# Altium project CCCSN.PrjPcb
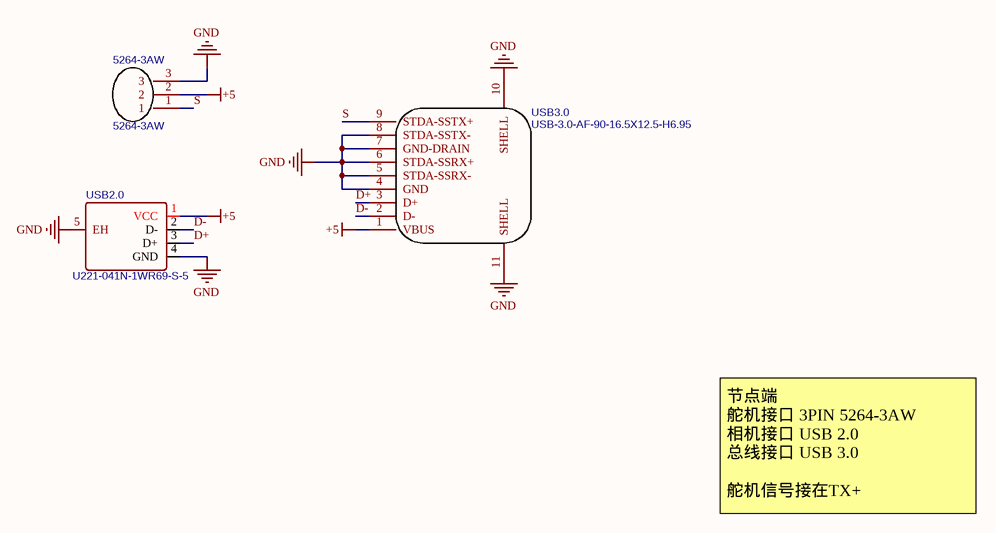
[diagram p0: Switchboard_node.SchDoc]
3 sheets, 18 parts. Net scope: global (net labels, ports and power ports of the same name join across sheets).
Board files: Switchboard_node.PcbDoc, Switchboard_host.PcbDoc, Power.PcbDoc
Sheets:
  Switchboard_node.SchDoc
  Switchboard_host.SchDoc
  Power.SchDoc

## Sheet Switchboard_node.SchDoc
size A4

### Parts
(Parts that share a designator on the sheet are numbered #1, #2 ... from top to bottom, then left to right.)
5264-3AW  5264-3AW  [CONN-TH_5264-3AW]
USB2.0#1  U221-041N-1WR69-S-5  [USB-A-TH_U221-041N-1WR69-S-5]
USB3.0#1  USB-3.0-AF-90-16.5X12.5-H6.95  [USB-3.0-TH_C69073]

### Nets
+5: 5264-3AW.2 USB2.0#1.1(VCC) USB3.0#1.1(VBUS)
GND: 5264-3AW.3 USB2.0#1.4(GND) USB2.0#1.5(EH) USB3.0#1.4(GND) USB3.0#1.5(STDA-SSRX-) USB3.0#1.6(STDA-SSRX+) USB3.0#1.7(GND-DRAIN) USB3.0#1.8(STDA-SSTX-) USB3.0#1.10(SHELL) USB3.0#1.11(SHELL)
D+: USB2.0#1.3(D+) USB3.0#1.3(D+)
D-: USB2.0#1.2(D-) USB3.0#1.2(D-)
S: 5264-3AW.1 USB3.0#1.9(STDA-SSTX+)

### Notes on the sheet
- 节点端
  舵机接口 3PIN 5264-3AW
  相机接口 USB 2.0
  总线接口 USB 3.0
  舵机信号接在TX+

### Library data of the parts
5264-3AW = 5264-3AW: BOM_Manufacturer: ReliaPro; BOM_Paste Type: expand; BOM_Supplier: LCSC; BOM_Manufacturer Part: 5264-3AW; BOM_Supplier Part: C48374; spicePre: C; spiceSymbolName: 5264-3AW
USB2.0#1 = U221-041N-1WR69-S-5: BOM_Manufacturer: XKB Connectivity; Contributor: LCSC; BOM_Supplier: LCSC; BOM_Supplier Part: C725877; BOM_Manufacturer Part: U221-041N-1WR69-S-5; spicePre: U; spiceSymbolName: U221-041N-1WR69-S-5
USB3.0#1 = USB-3.0-AF-90-16.5X12.5-H6.95: BOM_Manufacturer: LCSC; BOM_Paste Type: expand; BOM_Supplier: LCSC; BOM_Supplier Part: C69073; BOM_Manufacturer Part: USB-3.0-AF-90-16.5X12.5-H6.95; Contributor: LCSC; spicePre: U; spiceSymbolName: USB-3.0-AF-90-16.5X12.5-H6.95

## Sheet Switchboard_host.SchDoc
size A4
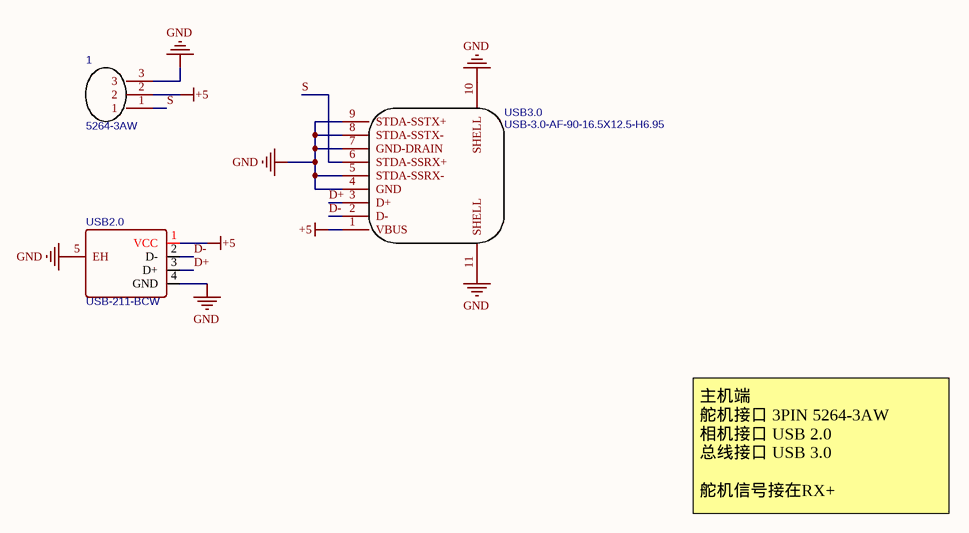
[diagram p1: Switchboard_host.SchDoc]

### Parts
(Parts that share a designator on the sheet are numbered #1, #2 ... from top to bottom, then left to right.)
1  5264-3AW  [CONN-TH_5264-3AW]
USB2.0#2  USB-211-BCW  [USB-A-TH_USB-211-BCW]
USB3.0#2  USB-3.0-AF-90-16.5X12.5-H6.95  [USB-3.0-TH_C69073]

### Nets
+5: 1.2 USB2.0#2.1(VCC) USB3.0#2.1(VBUS)
GND: 1.3 USB2.0#2.4(GND) USB2.0#2.5(EH) USB3.0#2.4(GND) USB3.0#2.5(STDA-SSRX-) USB3.0#2.7(GND-DRAIN) USB3.0#2.8(STDA-SSTX-) USB3.0#2.9(STDA-SSTX+) USB3.0#2.10(SHELL) USB3.0#2.11(SHELL)
D+: USB2.0#2.3(D+) USB3.0#2.3(D+)
D-: USB2.0#2.2(D-) USB3.0#2.2(D-)
S: 1.1 USB3.0#2.6(STDA-SSRX+)

### Notes on the sheet
- 主机端
  舵机接口 3PIN 5264-3AW
  相机接口 USB 2.0
  总线接口 USB 3.0
  舵机信号接在RX+

### Library data of the parts
1 = 5264-3AW: as 5264-3AW on sheet Switchboard_node; BOM_Supplier: LCSC; BOM_Manufacturer Part: 5264-3AW; BOM_Supplier Part: C48374; spicePre: C; spiceSymbolName: 5264-3AW
USB2.0#2 = USB-211-BCW: BOM_Manufacturer: XUNPU; Contributor: LCSC; BOM_Paste Type: expand; BOM_Supplier: LCSC; BOM_Supplier Part: C720520; BOM_Manufacturer Part: USB-211-BCW; spicePre: U; spiceSymbolName: USB-211-BCW
USB3.0#2 = USB-3.0-AF-90-16.5X12.5-H6.95: as USB3.0#1 on sheet Switchboard_node; BOM_Supplier: LCSC; BOM_Supplier Part: C69073; BOM_Manufacturer Part: USB-3.0-AF-90-16.5X12.5-H6.95; Contributor: LCSC; spicePre: U; spiceSymbolName: USB-3.0-AF-90-16.5X12.5-H6.95

## Sheet Power.SchDoc
size A4
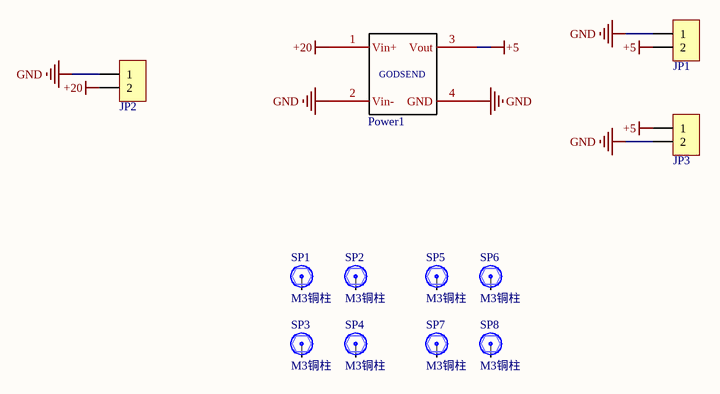
[diagram p2: Power.SchDoc]

### Parts
JP1  HDR-1X2  [KF301-5.0-2P]  (value not drawn)
JP2  HDR-1X2  [KF301-5.0-2P]  (value not drawn)
JP3  HDR-1X2  [KF301-5.0-2P]  (value not drawn)
Power1  GODSEND  [GODSEND]  (value not drawn)
SP1  M3铜柱  [M3x10_L]
SP2  M3铜柱  [M3x10_L]
SP3  M3铜柱  [M3x10_L]
SP4  M3铜柱  [M3x10_L]
SP5  M3铜柱  [M3x10_L]
SP6  M3铜柱  [M3x10_L]
SP7  M3铜柱  [M3x10_L]
SP8  M3铜柱  [M3x10_L]

### Nets
+5: JP1.2 JP3.1 Power1.3(Vout)
+20: JP2.2 Power1.1(Vin+)
GND: JP1.1 JP2.1 JP3.2 Power1.2(Vin-) Power1.4(GND)

Not connected (* = marked no-connect by the designer): SP1 1; SP2 1; SP3 1; SP4 1; SP5 1; SP6 1; SP7 1; SP8 1

### Library data of the parts
JP1-JP3 = Header 2: 2P接插件; 版权归属: 源创客; BOM名称: 2P接插件; 学习资源: www.ooocke.com
Power1 = GODSEND: pin to pad: 1>2 2>1 3>4 4>3
SP1-SP8 = 铜柱小焊盘: 铜柱; 版权归属: 源创客; BOM名称: 铜柱; 学习资源: www.ooocke.com

## Nets that join several sheets
+5: Switchboard_node (5264-3AW.2 USB2.0#1.1 USB3.0#1.1), Switchboard_host (1.2 USB2.0#2.1 USB3.0#2.1), Power (JP1.2 JP3.1 Power1.3)
GND: Switchboard_node (10 pins), Switchboard_host (10 pins), Power (5 pins)
D+: Switchboard_node (USB2.0#1.3 USB3.0#1.3), Switchboard_host (USB2.0#2.3 USB3.0#2.3)
D-: Switchboard_node (USB2.0#1.2 USB3.0#1.2), Switchboard_host (USB2.0#2.2 USB3.0#2.2)
S: Switchboard_node (5264-3AW.1 USB3.0#1.9), Switchboard_host (1.1 USB3.0#2.6)